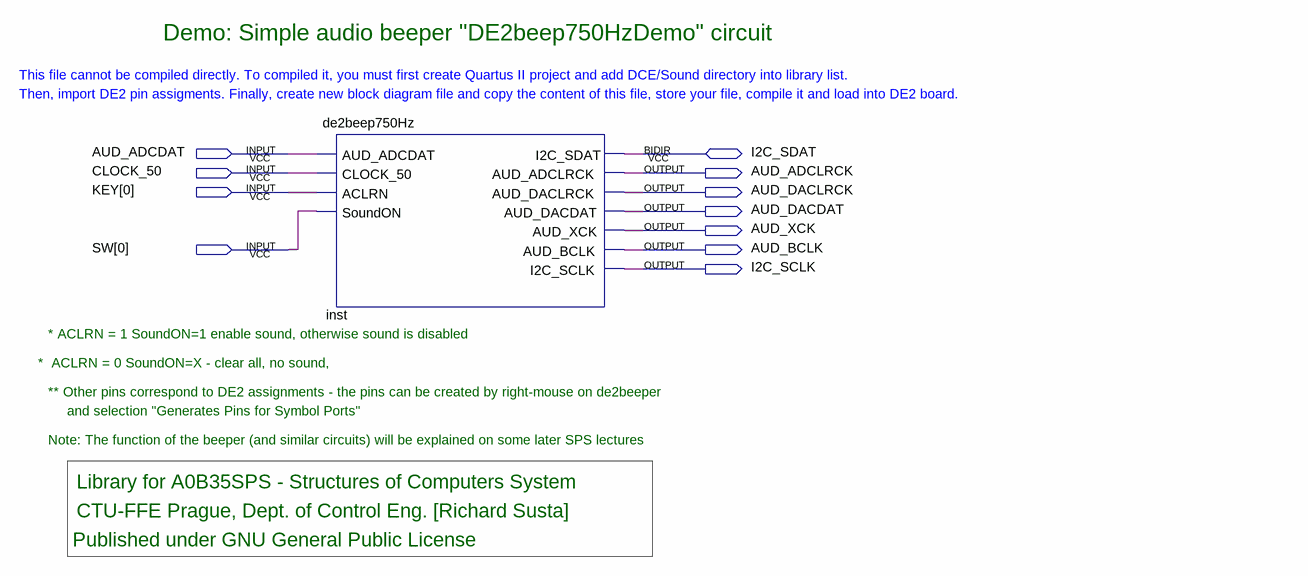
[diagram p0: schematic sheet]
// Quartus schematic test_DE2beep750Hz.bdf as structural Verilog: 1 symbols, 11 pins
module test_DE2beep750Hz (
  input  AUD_ADCDAT,
  input  CLOCK_50,
  input  [0:0] KEY,
  input  [0:0] SW,
  inout  I2C_SDAT,
  output AUD_ADCLRCK,
  output AUD_DACLRCK,
  output AUD_DACDAT,
  output AUD_XCK,
  output AUD_BCLK,
  output I2C_SCLK
);

  de2beep750Hz inst (
    .AUD_ADCDAT(AUD_ADCDAT), .CLOCK_50(CLOCK_50), .ACLRN(KEY[0]), .SoundON(SW[0]), .AUD_ADCLRCK(AUD_ADCLRCK),
    .AUD_DACLRCK(AUD_DACLRCK), .AUD_DACDAT(AUD_DACDAT), .AUD_XCK(AUD_XCK), .AUD_BCLK(AUD_BCLK),
    .I2C_SCLK(I2C_SCLK), .I2C_SDAT(I2C_SDAT));

  // Notes on the sheet:
  //   Demo: Simple audio beeper "DE2beep750HzDemo" circuit
  //   This file cannot be compiled directly. To compiled it, you must first create Quartus II project and add DCE/Sound directory into library list.
  //   Then, import DE2 pin assigments. Finally, create new block diagram file and copy the content of this file, store your file, compile it and load into DE2 board.
  //   * ACLRN = 1 SoundON=1 enable sound, otherwise sound is disabled
  //   *  ACLRN = 0 SoundON=X - clear all, no sound,
  //   ** Other pins correspond to DE2 assignments - the pins can be created by right-mouse on de2beeper 
  //   and selection "Generates Pins for Symbol Ports"
  //   Note: The function of the beeper (and similar circuits) will be explained on some later SPS lectures
  //   Library for A0B35SPS - Structures of Computers System
  //   CTU-FFE Prague, Dept. of Control Eng. [Richard Susta]
  //    Published under GNU General Public License
endmodule
